# EAGLE design NinjaPCR-131101 (EAGLE 6.3)
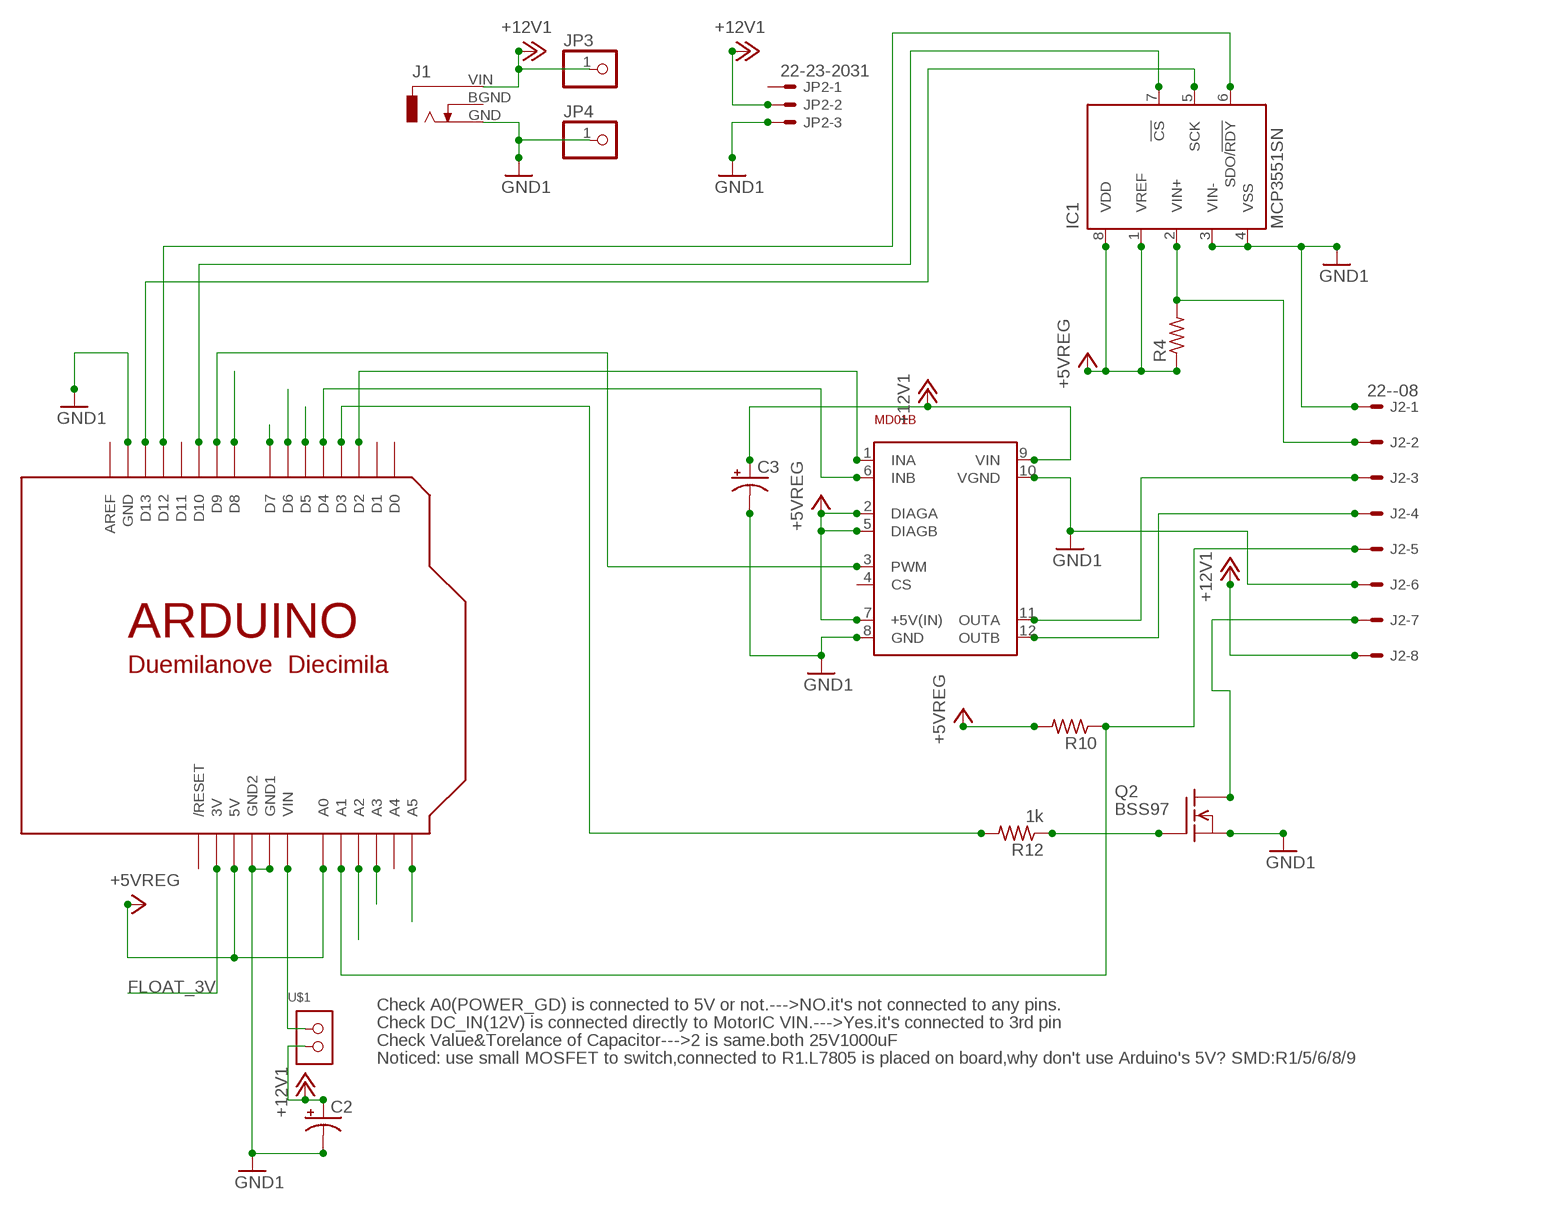
[diagram p0: schematic, sheet 1]

## Parts
C2  CPOL-USE5-8.5  [E5-8,5]
C3  CPOL-USE5-13  [E5-13]
IC1  MCP3551SN  [SO-08]
J1  DCJ0303  [DCJ0303]
J2  22--08  [POLOLU-8-VERTICAL]
JP2  22-23-2031  [22-23-2031]
JP3  PINHD-1X1  [1X01]
JP4  PINHD-1X1  [1X01]
MD01B  VNH3SP30+4PINN  [VNH3SP30+4PIN_NOHOLES]
Q2  BSS97  [TO202]
R4  R-US_0207/10  [0207/10]
R10  R-US_0207/10  [0207/10]
R12  1k  R-US_0207/10  [0207/10]
U$1  1X02  [1X02_1.1_UNSIGNED]
U$3  ARDUINODUEMILANOVE  [ARDUINO]

## Nets
+5VREG [2A]: IC1.1(VREF) IC1.8(VDD) MD01B.2(DIAGA) MD01B.5(DIAGB) MD01B.7(+5V(IN)) R4.1 R10.2 U$3.5V U$3.A0
+12V1 [8A]: C2.+ C3.+ J1.VIN J2.8 JP2.2 JP3.1 MD01B.9(VIN) U$1.2
D13: IC1.5(SCK) U$3.D13
FLOAT_3V: U$3.3V
GND1 [2A]: C2.- C3.- IC1.3(VIN-) IC1.4(VSS) J1.GND J2.1 J2.6 JP2.3 JP4.1 MD01B.8(GND) MD01B.10(VGND) Q2.1(S) U$3.GND U$3.GND1 U$3.GND2
N$1: U$3.D8
N$2: U$3.D6
N$3: U$3.D5
N$4: U$3.A3
N$5: U$1.1 U$3.VIN
N$6: U$3.A2
N$7: U$3.A5
N$8: R12.2 U$3.D3
N$9: J2.3 MD01B.11(OUTA)
N$10: J2.4 MD01B.12(OUTB)
N$11: U$3.D7
N$18 [3A]: J2.7 Q2.2(D)
N$23: IC1.2(VIN+) J2.2 R4.2
N$27: IC1.6(SDO/!RDY) U$3.D12
N$29: IC1.7(!CS) U$3.D10
N$37: J2.5 R10.1 U$3.A1
S$1: MD01B.1(INA) U$3.D2
S$2: MD01B.3(PWM) U$3.D9
S$3: MD01B.6(INB) U$3.D4
T1: Q2.3(G) R12.1
Unconnected: J1.BGND JP2.1 MD01B.4(CS) U$3.A4 U$3.AREF U$3.D0 U$3.D1 U$3.D11 U$3.RESET(/RESET)

## Notes on the sheet
- Check A0(POWER_GD) is connected to 5V or not.--->NO.it's not connected to any pins.
- Check DC_IN(12V) is connected directly to MotorIC VIN.--->Yes.it's connected to 3rd pin
- Check Value&Torelance of Capacitor--->2 is same.both 25V1000uF
- Noticed: use small MOSFET to switch,connected to R1.L7805 is placed on board,why don't use Arduino's 5V? SMD:R1/5/6/8/9

## Library data of the parts
C2 C3 = rcl:CPOL-US: POLARIZED CAPACITOR, American symbol
IC1 = microchip:MCP355*: Low-Power, Single-Channel 22-Bit Delta-Sigma ADCs Source: http://ww1.microchip.com/downloads/en/DeviceDoc/21950c.pdf; MPN: MCP3551-E/SN; OC_FARNELL: 1084625; OC_NEWARK: 97K4494
J1 = JACK:DCJ0303: DC POWER JACK Source: DCJ0303.pdf; OC_FARNELL: unknown; OC_NEWARK: unknown
J2 = con-molex:22-?-08: CONNECTOR wire to board 2.54 mm (.1 inch) pitch header
JP2 = con-molex:22-23-2031: .100" (2.54mm) Center Header - 3 Pin; MF: MOLEX; MPN: 22-23-2031; OC_FARNELL: 1462950; OC_NEWARK: 30C0862
JP3 JP4 = pinhead:PINHD-1X1: PIN HEADER
MD01B = MOTORDRIVE:VNH3SP30+4PIN
Q2 = openpcr:BSS97: N-Channel Enhancement MOSFET 200V; 1.5A; 1,6Ohm
R4 R10 R12 = resistor:R-US_: RESISTOR, American symbol
U$1 = PIN:1X02
U$3 = openpcr:ARDUINO: Arduino Diecimila/Duemilanove Make a shield with ease, this package has all the named pins as well as the two mounting drill holes and an outline of the USB and DC power connector. The outline is on the DIMENSION layer, so if your board house uses it they will cut the outline to match. http://www.ladyada.net/library/pcb/eaglelibrary.html

## Net classes
0 default: width 0.381 mm
1 2A: width 0.406 mm
2 8A: width 2.54 mm
3 3A: width 1.016 mm

## Board
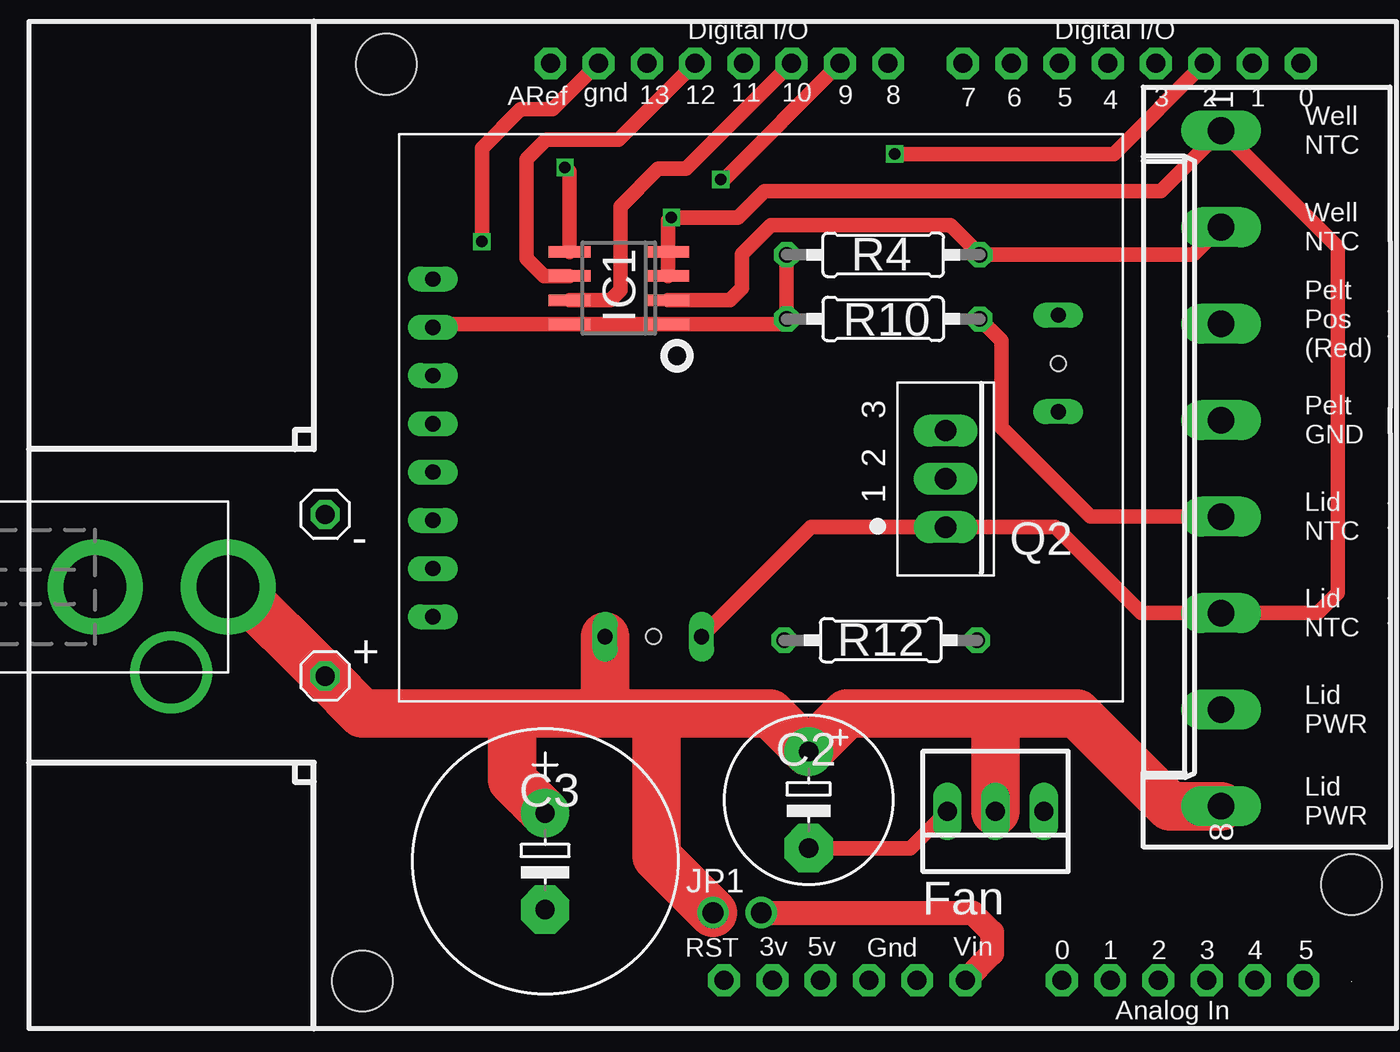
[diagram p1: board, top side]
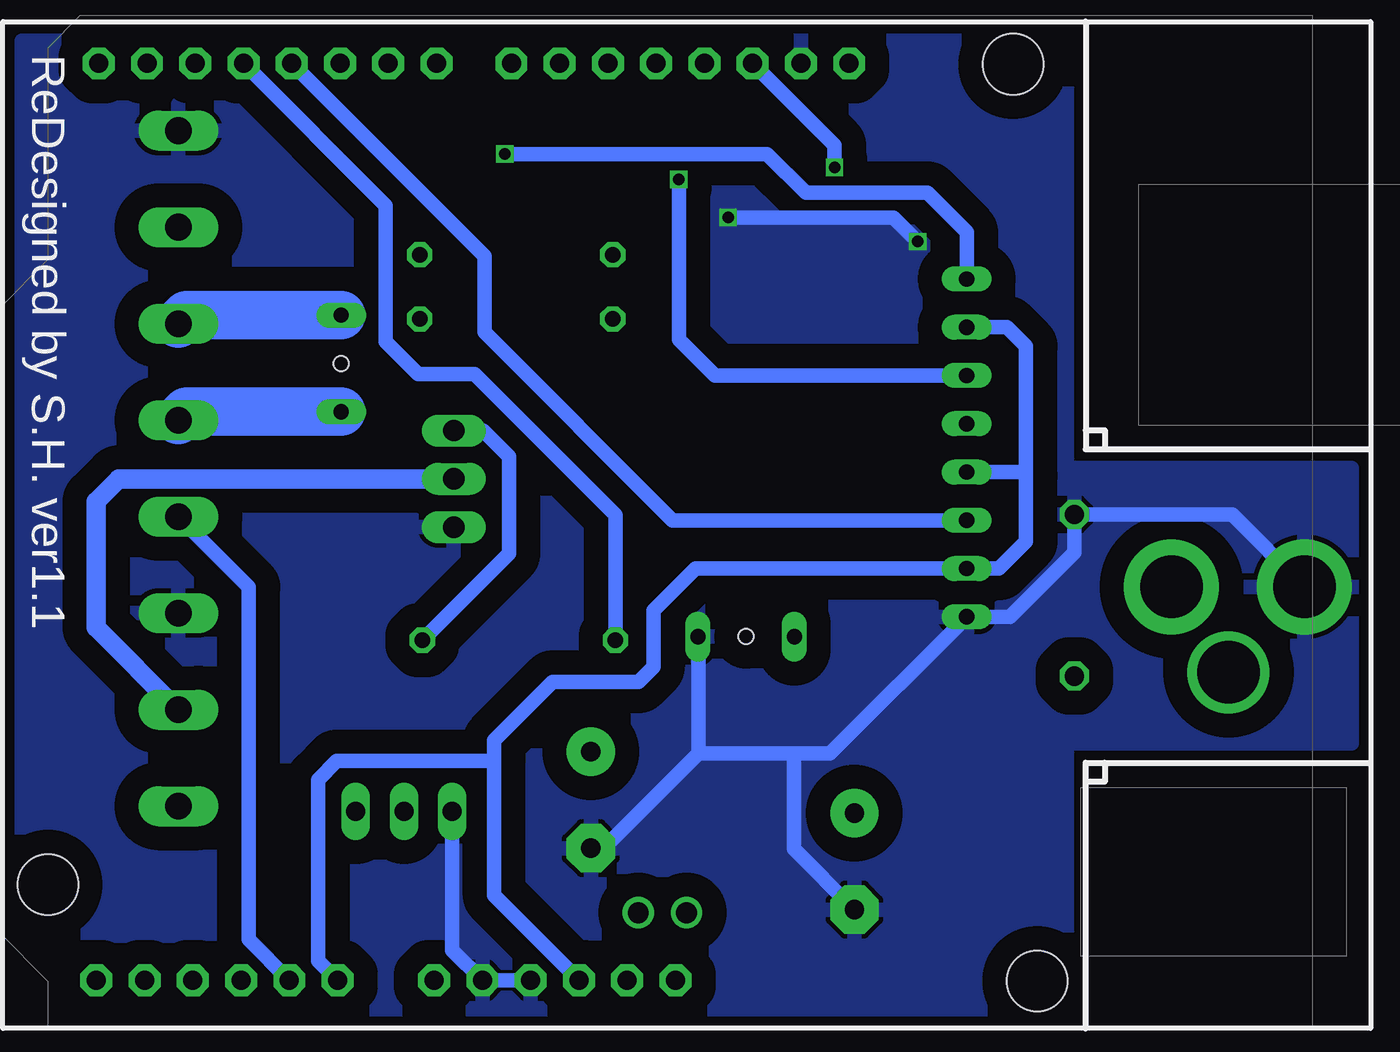
[diagram p2: board, bottom side, seen from below]

No outline drawn. Coordinates in mm, seen from the top.
Copper layers (1*16): Top 0.035mm / dielectric 1.5mm / Bottom 0.035mm
Design rules "Fusion_eagle_rule_v1.1": minimum track width 6mil, minimum drill 12mil, track to track 6mil, track to pad 6mil, pad to pad 6mil, via to via 6mil, smd to smd 0mil, copper to edge 10mil, drill to drill 10mil, minimum pad ring 10mil, minimum via ring 6mil, stop-mask expansion 2mil, vias tented up to drill 100mil, thermal gap 10mil

### Footprints (pad centres in the part's own frame; a part is rotated, then mirrored left to right if it is on the bottom)
E5-8,5 = drill 1.016 pad 2.54: + -2.54,0 | drill 1.016 pad 2.54 octagon: - 2.54,0
E5-13 = drill 1.016 pad 2.54: + -2.54,0 | drill 1.016 pad 2.54 octagon: - 2.54,0
SO-08 = smd 0.6 x 2.2: 1 -1.905,-2.6; 2 -0.635,-2.6; 3 0.635,-2.6; 4 1.905,-2.6; 5 1.905,2.6; 6 0.635,2.6; 7 -0.635,2.6; 8 -1.905,2.6
DCJ0303 = drill 3.3 pad 4: BGND 4.5,-3 | drill 3.3 pad 5: GND 0,-7; VIN 0,0
POLOLU-8-VERTICAL = drill 1.4 long: 1 17.78,0; 2 12.7,0; 3 7.62,0; 4 2.54,0; 5 -2.54,0; 6 -7.62,0; 7 -12.7,0; 8 -17.78,0
22-23-2031 = drill 1 long: 1 -2.54,0; 2 0,0; 3 2.54,0
1X01 = drill 1.016 octagon: 1 0,0
VNH3SP30+4PIN_NOHOLES = drill 0.8 long: 1 1.778,22.225; 2 1.778,19.685; 3 1.778,17.145; 4 1.778,14.605; 5 1.778,12.065; 6 1.778,9.525; 7 1.778,6.985; 8 1.778,4.445; 9 10.846,3.4; 10 15.926,3.4; 11 34.7,20.32; 12 34.7,15.24 | hole 0.8: 34.7,17.78; 13.386,3.4
TO202 = drill 1.118 long: 1 -2.54,-5.08; 2 0,-5.08; 3 2.54,-5.08
0207/10 = drill 0.813 octagon: 1 -5.08,0; 2 5.08,0
1X02_1.1_UNSIGNED = drill 1.1: 1 -2.54,0; 2 0,0
ARDUINO = drill 1 pad 1.676 octagon: 3V 36.068,2.54; 5V 38.608,2.54; A0 51.308,2.54; A1 53.848,2.54; A2 56.388,2.54; A3 58.928,2.54; A4 61.468,2.54; A5 64.008,2.54; AREF 24.384,50.8; D0 63.881,50.8; D1 61.341,50.8; D2 58.801,50.8; D3 56.261,50.8; D4 53.721,50.8; D5 51.181,50.8; D6 48.641,50.8; D7 46.101,50.8; D8 42.164,50.8; D9 39.624,50.8; D10 37.084,50.8; D11 34.544,50.8; D12 32.004,50.8; D13 29.464,50.8; GND 26.924,50.8; GND1 43.688,2.54; GND2 41.148,2.54; RESET 33.528,2.54; VIN 46.228,2.54 | hole 3.2: 15.758,50.754; 66.558,7.574; 14.488,2.494

### Placement (x,y rotation side)
C2  41.05,12.03 270 top
C3  27.18,8.8 270 top
IC1  31.06,38.97 90 top
J1  10.49,23.25 270 top
J2  62.76,29.48 90 top
JP2  50.89,11.43 180 top
JP3  15.6,18.55 270 top
JP4  15.6,27.06 270 top
MD01B  19.49,17.23 0 top
Q2  43.18,28.93 90 top
R4  44.97,40.73 0 top
R10  44.97,37.35 180 top
R12  44.84,20.44 180 top
U$1  36.01,6.1 180 top
U$3  3.07,0 0 top

### Tracks (layer width: path | path; a pad name or v marks a point on that pad's centre or on a via)
+5VREG
  Top 0.762: MD01B.2 21.42,37.07 IC1.8 IC1.1 39.61,37.07 R10.2 R4.1
  Bottom 0.762: 18.14,29.1 18.14,25.64 19.57,24.21 MD01B.7 35.54,24.21 37.75,22 37.75,19.02 38.53,18.24 43.05,18.24 46.14,15.16 46.14,14.17 | 18.14,29.1 18.14,35.91 19.14,36.91 MD01B.2 | MD01B.5 18.33,29.29 18.14,29.1 | U$3.5V 46.14,7 46.14,14.17 | U$3.A0 55.41,3.57 55.41,13.1 54.43,14.07 46.23,14.07 46.14,14.17
+12V1
  Top 2.54: 30.16,16.59 25.43,16.59 | 25.43,16.59 17.56,16.59 JP3.1 10.9,23.25 J1.VIN | MD01B.9 30.34,16.77 30.16,16.59 | 30.16,16.59 33.05,16.59 | JP2.2 50.89,16.59 | U$1.2 33.05,9.06 33.05,16.59 | C3.+ 25.43,13.09 25.43,16.59 | 33.05,16.59 39.02,16.59 C2.+ 43.08,16.59 50.89,16.59 | 50.89,16.59 55.17,16.59 60.07,11.7 J2.8
D13  (via drill 0.6)
  Top 0.762: IC1.5 28.46,45.09 v28.22,45.32
  Bottom 0.762: v28.22,45.32 28.22,46.49 U$3.D13
GND1  (via drill 0.6)
  Top 0.762: MD01B.10 41.18,26.39 Q2.1 54.03,26.39 58.56,21.86 J2.6 67.83,21.86 68.89,22.91 68.89,41.14 J2.1 59.58,44.08 38.71,44.08 37.33,42.69 v33.82,42.69 33.66,42.52 IC1.4 IC1.3 | U$3.GND 27.58,48.38 25.89,48.38 23.85,46.34 v23.85,41.42 | C2.- 46.41,9.49 JP2.3
  Bottom 0.762: U$3.GND2 U$3.GND1 48.35,4.13 JP2.3 | v23.85,41.42 25.12,42.69 v33.82,42.69 | 35.4,14.47 35.4,20.61 MD01B.10 | J1.GND 7.3,27.06 JP4.1 15.6,25.06 18.99,21.67 MD01B.8 28.46,14.47 30.36,14.47 | 30.36,14.47 35.4,14.47 | C3.- 30.36,9.44 30.36,14.47 | 35.4,14.47 40.38,9.49 C2.-
  pour Bottom (isolate 1.27): 16,52 71,52 71,1 16,1 16,15 1,15 1,29.5 16,29.5
N$5
  Top 1.27: U$1.1 49.68,6.1 50.7,5.07 50.7,3.95 U$3.VIN
N$8
  Bottom 0.762: R12.2 39.76,27.03 47.18,34.45 50.14,34.45 51.85,36.16 51.85,43.32 U$3.D3
N$9
  Bottom 2.54: MD01B.11 62.32,37.55 J2.3
N$10
  Bottom 2.54: MD01B.12 62.32,32.47 J2.4
N$18
  Bottom 1.016: Q2.2 65.89,28.93 67.08,27.75 67.08,21.1 J2.7
N$23
  Top 0.762: IC1.2 36.9,38.34 37.54,38.98 37.54,40.77 39.05,42.27 48.5,42.27 R4.2 61.3,40.73 J2.2
N$27
  Top 0.762: IC1.6 27.11,39.61 26.2,40.52 26.2,45.75 27.22,46.78 31.05,46.78 U$3.D12
N$29
  Top 0.762: IC1.7 30.62,38.34 31.14,38.86 31.14,43.27 33.13,45.25 34.61,45.25 U$3.D10
N$37
  Top 0.762: R10.1 51.18,36.21 51.18,31.64 55.88,26.94 J2.5
  Bottom 0.762: U$3.A1 59.06,4.68 59.06,23.24 J2.5
S$1  (via drill 0.6)
  Top 0.762: v45.57,46.03 57.1,46.03 U$3.D2
  Bottom 0.762: MD01B.1 21.27,41.92 23.33,43.98 29.74,43.98 31.79,46.03 v45.57,46.03
S$2  (via drill 0.6)
  Top 0.762: U$3.D9 36.59,44.69 v36.42,44.69
  Bottom 0.762: MD01B.3 34.52,34.37 36.42,36.27 v36.42,44.69
S$3
  Bottom 0.762: MD01B.6 36.74,26.75 46.66,36.67 46.66,40.66 U$3.D4
T1
  Bottom 0.762: R12.1 45.36,25 45.36,30.12 46.71,31.47 Q2.3

### Text on the board
tPlace: Well / NTC | Well / NTC | R4 | IC1 | R10 | Pelt / Pos / (Red) | Pelt / GND | Lid / NTC | - | Q2 | Lid / NTC | R12 | + | Lid / PWR | C2 | C3 | Lid / PWR | JP1 | Fan
bPlace: ReDesigned by S.H. ver1.1